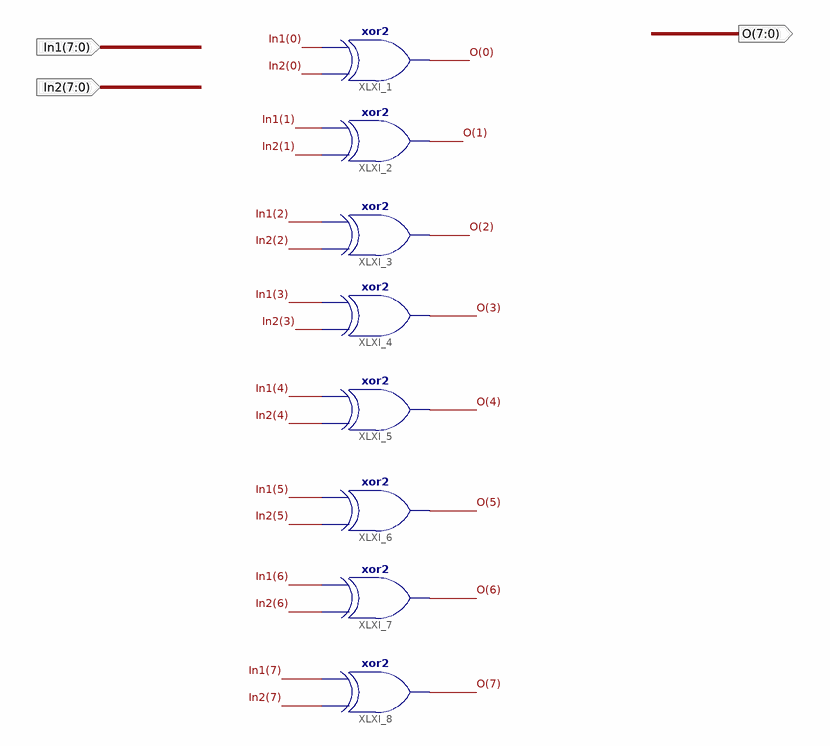
[diagram p0: schematic sheet 1]
// Xilinx ISE schematic xor8b2.sch (spartan3e) as structural Verilog: 8 symbols, 3 ports
module xor8b2 (
  input  [7:0] In1,
  input  [7:0] In2,
  output [7:0] O
);

  xor XLXI_1 (O[0], In2[0], In1[0]);
  xor XLXI_2 (O[1], In2[1], In1[1]);
  xor XLXI_3 (O[2], In2[2], In1[2]);
  xor XLXI_4 (O[3], In2[3], In1[3]);
  xor XLXI_5 (O[4], In2[4], In1[4]);
  xor XLXI_6 (O[5], In2[5], In1[5]);
  xor XLXI_7 (O[6], In2[6], In1[6]);
  xor XLXI_8 (O[7], In2[7], In1[7]);
endmodule
